# Altium project Kepler.PrjPcb
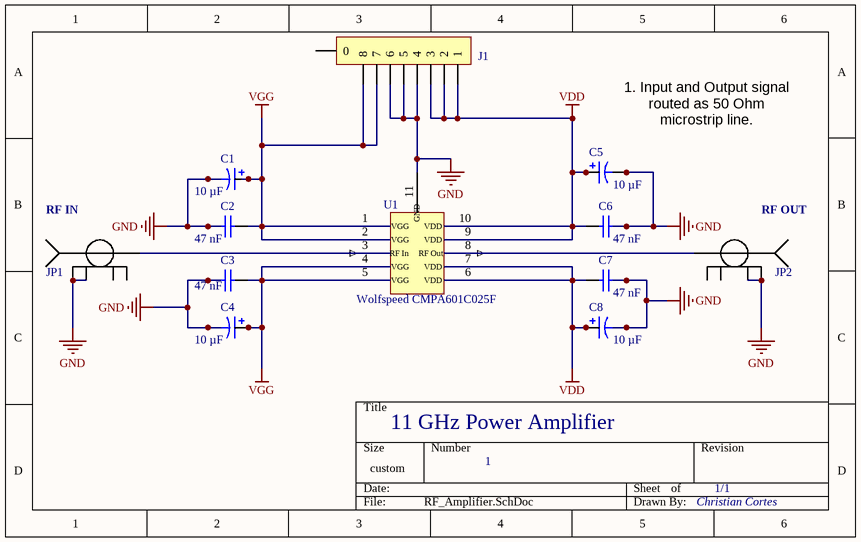
[diagram p0: RF_Amplifier.SchDoc]
1 sheet, 12 parts. Net scope: global (net labels, ports and power ports of the same name join across sheets).

## Sheet RF_Amplifier.SchDoc
size 160 x 100 mm; Engineer: Christian David Cortes Rivera; Organization: Kepler Communications; SheetNumber: 1; SheetTotal: 1

### Parts
C1  Capacitance: 10 µF  [PCB-11675369-2]  (hidden comment: Panasonic 10SVP10M)
C2  Capacitance: 47 nF  [CAPC3216X94X50ML20T25]  (hidden comment: AVX Interconnect / Elco 12061C473KAT2A)
C3  Capacitance: 47 nF  [CAPC3216X94X50ML20T25]  (hidden comment: AVX Interconnect / Elco 12061C473KAT2A)
C4  Capacitance: 10 µF  [PCB-11675369-2]  (hidden comment: Panasonic 10SVP10M)
C5  Capacitance: 10 µF  [PCB-11675369-2]  (hidden comment: Panasonic 10SVP10M)
C6  Capacitance: 47 nF  [CAPC3216X94X50ML20T25]  (hidden comment: AVX Interconnect / Elco 12061C473KAT2A)
C7  Capacitance: 47 nF  [CAPC3216X94X50ML20T25]  (hidden comment: AVX Interconnect / Elco 12061C473KAT2A)
C8  Capacitance: 10 µF  [PCB-11675369-2]  (hidden comment: Panasonic 10SVP10M)
J1  Molex 53398-0871  [PCB-330964-1]  (value not drawn)
JP1  Molex 73251-2120  [PCB-gjx2rcg91tbhfhdn1i9r-1]  (value not drawn)
JP2  Molex 73251-2120  [PCB-gjx2rcg91tbhfhdn1i9r-1]  (value not drawn)
U1  Wolfspeed CMPA601C025F  [Wolfspeed CMPA601C025F-Footprint-1]

### Nets
GND: C1.2 C2.1 C3.1 C4.2 C5.2 C6.2 C7.2 C8.2 J1.4 J1.5 J1.6 JP1.2(gnd) JP1.3(gnd) JP2.2(gnd) JP2.3(gnd)
VDD: C5.1 C6.1 C7.1 C8.1 J1.1 J1.2 J1.3 U1.6(VDD) U1.7(VDD) U1.9(VDD) U1.10(VDD)
VGG: C1.1 C2.2 C3.2 C4.1 J1.7 J1.8 U1.1(VGG) U1.2(VGG) U1.4(VGG) U1.5(VGG)
NetJP1_1: JP1.1(rf) U1.3(RF_In)
NetJP2_1: JP2.1(rf) U1.8(RF_Out)

Not connected (* = marked no-connect by the designer): J1 0; JP1 4(gnd) 5(gnd); JP2 4(gnd) 5(gnd); U1 11(GND)

### Notes on the sheet
- (near C5) 1. Input and Output signal routed as 50 Ohm microstrip line.
- (near JP1) RF IN
- (near JP2) RF OUT
- 11 GHz Power Amplifier
- 1
- 1/1
- Christian Cortes

### Library data of the parts
C1 C4 C5 C8 = CMP-11675369-3: CAP ALUM 10UF 10V 20% SMD; Equivalent Series Resistance (ESR): 0.22 Ω; Lead-Free Status: Lead Free; Voltage Rating (DC): 10.0 V; Capacitance Tolerance: ±20%; Lifecycle Status: Not Listed by Manufacturer; Octopart Url: https://octopart.com/10svp10m-panasonic-29498231; OctopartID: 0b69c3a13578d4ae; Packaging: Cut Tape (CT); REACH SVHC Compliance: No SVHC; RoHS: Compliant; Size-Diameter: 0.004 m; Size-Height: 0.0054 m; Manufacturer Part Number: 10SVP10M
C2 C3 C6 C7 = CMP-126540-2: CAP CER 0.047UF 100V X7R 1206; Capacitance Tolerance: ±10%; Case/Package (SI): 3216; Dielectric Material: Ceramic Multilayer; Insulation Resistance: 1e+11 Ω; Lead-Free Status: Lead Free; Voltage Rating (DC): 100.0 V; Case/Package: 1206; Dielectric Characteristic: X7R; Mounting Style: Surface Mount; Number of Pins: 2; Octopart Url: https://octopart.com/12061c473kat2a-avx+interconnect+%2F+elco-55388089; OctopartID: 7c90b6d77e4fa357; REACH SVHC Compliance: No SVHC; RoHS: Compliant; Size-Height: 0.00094 m; Size-Length: 0.0032004 m; Size-Thickness: 0.0009398 m; Size-Width: 0.0016002 m; Manufacturer Part Number: 12061C473KAT2A
J1 = CMP-330964-5: Headers & Wire Housings VERTICAL HDR SMT 8P; Lead-Free Status: Lead Free; Gender: Male; Number of Positions: 8; Voltage Rating (DC): 125.0 V; Pin Pitch: 0.00125 m; Current Rating: 1.0 A; Glow Wire Compliant: Non-Compliant; Insulation Resistance: 100000000.0 Ω; Mated Height: 0.0057 m; Color: Natural; Halogen Free Status: Not Low Halogen; Lifecycle Status: Active; RoHS: Compliant; Size-Height: 0.0047 m; Orientation: Vertical; Contact Plating: Tin; Housing Color: Natural; Manufacturer Part Number: 53398-0871; OctopartID: 3988f08be32ce64f; Size-Length: 0.01515 m; Number of Circuits: 8; Contact Material: Phosphor Bronze; Flammability Rating: UL 94 V-0; Number of Rows: 1; Number of Contacts: 8; Octopart Url: https://octopart.com/53398-0871-molex-655298; Voltage Rating (AC): 125.0 V; Size-Width: 0.0037 m; Housing Material: Thermoplastic
JP1 JP2 = CMP-4dee84f7198e9229-5: Rf Coax Conn, Sma, Jack, 50 Ohm, Pcb; Lead-Free Status: Lead Free; Octopart URL: https://octopart.com/73251-2120-molex-1274118; Contact Material: Beryllium Copper; Halogen Free Status: Low Halogen; Manufacturer Part Number: 73251-2120; OctopartID: 4dee84f7198e9229; Lifecycle Status: Active; RoHS: Compliant; Footprint: PCB-gjx2rcg91tbhfhdn1i9r-2; Contact Plating: Gold; Orientation: Straight
U1 = CMP-1f77d3c5abf7c0b0-10: RF Amp Module Single Power Amp 12GHz 28V 11-Pin Case 440213; Manufacturer Part Number: CMPA601C025F - mod; ReplaceComponentId: ULZOSVGH; OctopartID: 1f77d3c5abf7c0b0; Octopart Url: https://octopart.com/cmpa601c025f-wolfspeed-95982054; PartId: 1